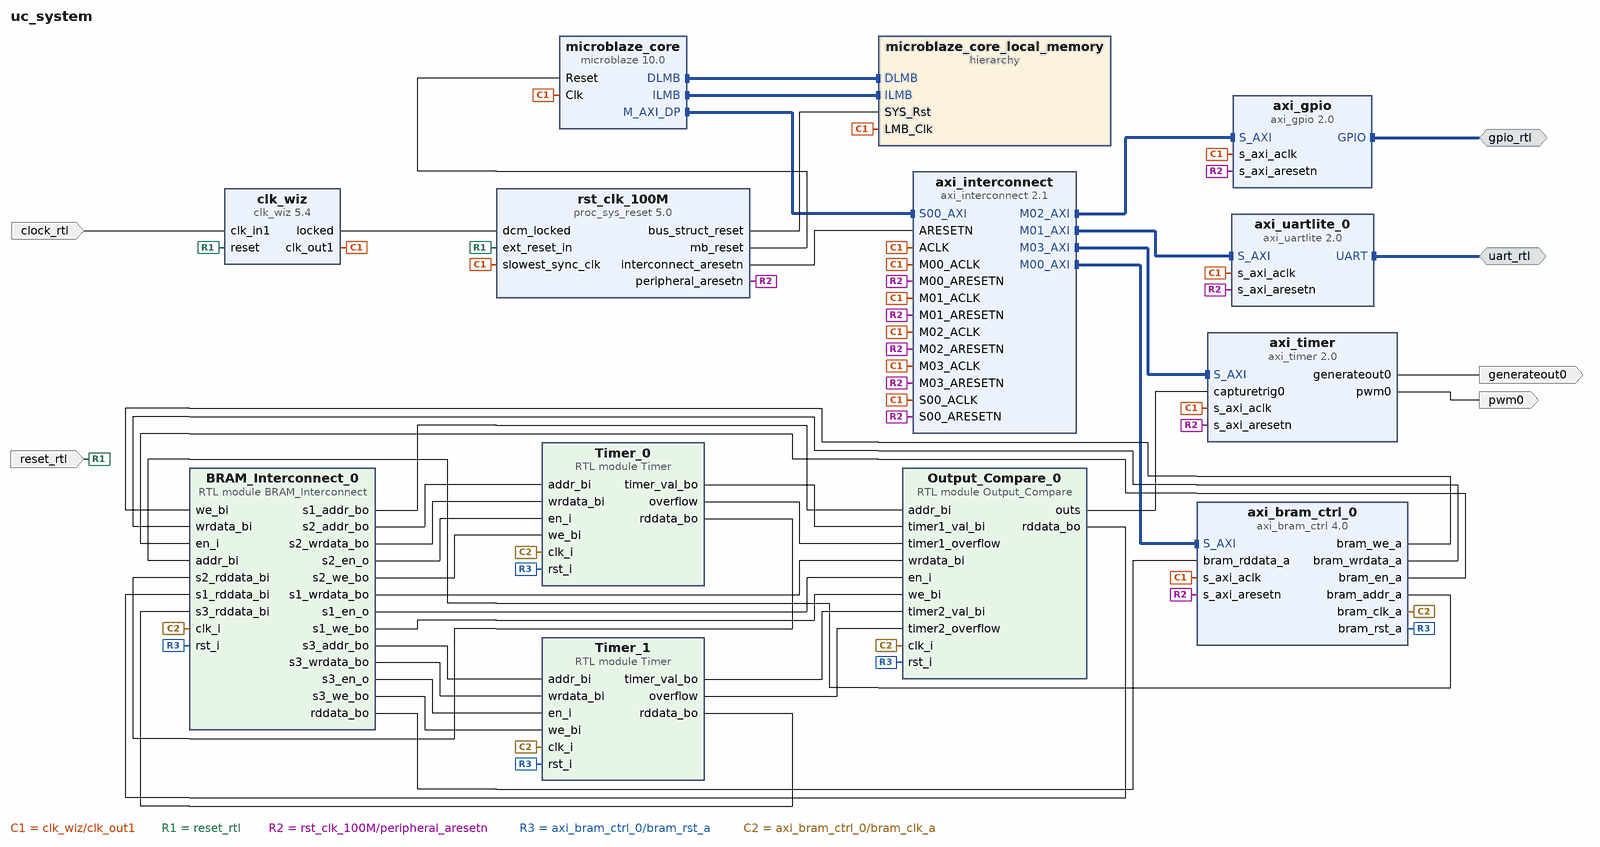
[diagram p0: block diagram of the top level]
# Vivado block design uc_system, xc7a100tcsg324-1, Vivado 2017.2
create_bd_design uc_system

create_bd_intf_port -mode Master -vlnv xilinx.com:interface:gpio_rtl:1.0 gpio_rtl
create_bd_intf_port -mode Master -vlnv xilinx.com:interface:uart_rtl:1.0 uart_rtl
create_bd_port -dir I -type rst reset_rtl
set_property -dict {CONFIG.POLARITY ACTIVE_HIGH} [get_bd_ports reset_rtl]
create_bd_port -dir I -type clk clock_rtl
set_property -dict {CONFIG.FREQ_HZ 100000000 CONFIG.PHASE 0.000} [get_bd_ports clock_rtl]
create_bd_port -dir O pwm0
create_bd_port -dir O generateout0

create_bd_cell -type ip -vlnv xilinx.com:ip:microblaze:10.0 microblaze_core
set_property -dict {CONFIG.C_D_AXI 1 CONFIG.C_D_LMB 1 CONFIG.C_I_LMB 1 CONFIG.C_DEBUG_ENABLED 0} [get_bd_cells microblaze_core]
create_bd_cell -type ip -vlnv xilinx.com:ip:clk_wiz:5.4 clk_wiz
create_bd_cell -type ip -vlnv xilinx.com:ip:proc_sys_reset:5.0 rst_clk_100M
create_bd_cell -type ip -vlnv xilinx.com:ip:axi_timer:2.0 axi_timer
create_bd_cell -type ip -vlnv xilinx.com:ip:axi_gpio:2.0 axi_gpio
set_property -dict {CONFIG.C_GPIO_WIDTH 16 CONFIG.C_ALL_OUTPUTS 1} [get_bd_cells axi_gpio]
create_bd_cell -type hier microblaze_core_local_memory
create_bd_cell -type ip -vlnv xilinx.com:ip:axi_interconnect:2.1 axi_interconnect
set_property -dict {CONFIG.NUM_MI 4} [get_bd_cells axi_interconnect]
create_bd_cell -type ip -vlnv xilinx.com:ip:axi_bram_ctrl:4.0 axi_bram_ctrl_0
set_property -dict {CONFIG.PROTOCOL AXI4 CONFIG.SINGLE_PORT_BRAM 1} [get_bd_cells axi_bram_ctrl_0]
create_bd_cell -type ip -vlnv xilinx.com:ip:axi_uartlite:2.0 axi_uartlite_0
set_property -dict {CONFIG.C_BAUDRATE 230400} [get_bd_cells axi_uartlite_0]
create_bd_cell -type module -reference BRAM_Interconnect BRAM_Interconnect_0
set_property -dict [list \
  CONFIG.addr1_0 24 \
  CONFIG.addr1_1 32 \
  CONFIG.addr2_0 0 \
  CONFIG.addr2_1 11 \
  CONFIG.addr3_0 12 \
  CONFIG.addr3_1 23 \
] [get_bd_cells BRAM_Interconnect_0]
create_bd_cell -type module -reference Timer Timer_0
create_bd_cell -type module -reference Timer Timer_1
set_property -dict {CONFIG.ADDRESS 0x0000000C} [get_bd_cells Timer_1]
create_bd_cell -type module -reference Output_Compare Output_Compare_0

# ---- hierarchy /microblaze_core_local_memory ----
current_bd_instance /microblaze_core_local_memory
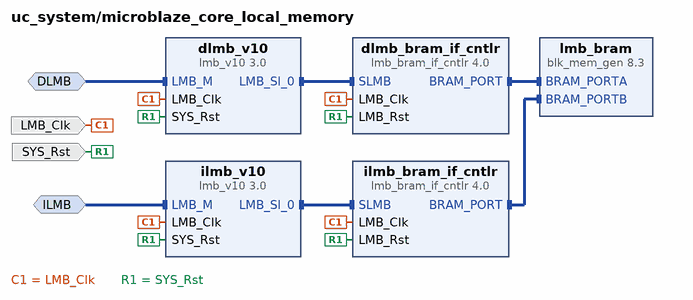
[diagram p1: block diagram inside /microblaze_core_local_memory]
create_bd_intf_pin -mode MirroredMaster -vlnv xilinx.com:interface:lmb_rtl:1.0 DLMB
create_bd_intf_pin -mode MirroredMaster -vlnv xilinx.com:interface:lmb_rtl:1.0 ILMB
create_bd_pin -dir I -type clk LMB_Clk
create_bd_pin -dir I -type rst SYS_Rst

create_bd_cell -type ip -vlnv xilinx.com:ip:lmb_v10:3.0 dlmb_v10
create_bd_cell -type ip -vlnv xilinx.com:ip:lmb_v10:3.0 ilmb_v10
create_bd_cell -type ip -vlnv xilinx.com:ip:lmb_bram_if_cntlr:4.0 dlmb_bram_if_cntlr
set_property -dict {CONFIG.C_ECC 0} [get_bd_cells dlmb_bram_if_cntlr]
create_bd_cell -type ip -vlnv xilinx.com:ip:lmb_bram_if_cntlr:4.0 ilmb_bram_if_cntlr
set_property -dict {CONFIG.C_ECC 0} [get_bd_cells ilmb_bram_if_cntlr]
create_bd_cell -type ip -vlnv xilinx.com:ip:blk_mem_gen:8.3 lmb_bram
set_property -dict {CONFIG.Memory_Type True_Dual_Port_RAM CONFIG.use_bram_block BRAM_Controller} [get_bd_cells lmb_bram]

# ---- connections ----

current_bd_instance /microblaze_core_local_memory
connect_bd_intf_net -intf_net microblaze_core_dlmb_bus [get_bd_intf_pins dlmb_v10/LMB_Sl_0] [get_bd_intf_pins dlmb_bram_if_cntlr/SLMB]
connect_bd_intf_net -intf_net microblaze_core_ilmb_bus [get_bd_intf_pins ilmb_v10/LMB_Sl_0] [get_bd_intf_pins ilmb_bram_if_cntlr/SLMB]
connect_bd_intf_net -intf_net microblaze_core_dlmb_cntlr [get_bd_intf_pins dlmb_bram_if_cntlr/BRAM_PORT] [get_bd_intf_pins lmb_bram/BRAM_PORTA]
connect_bd_intf_net -intf_net microblaze_core_ilmb_cntlr [get_bd_intf_pins ilmb_bram_if_cntlr/BRAM_PORT] [get_bd_intf_pins lmb_bram/BRAM_PORTB]
connect_bd_intf_net -intf_net microblaze_core_dlmb [get_bd_intf_pins DLMB] [get_bd_intf_pins dlmb_v10/LMB_M]
connect_bd_intf_net -intf_net microblaze_core_ilmb [get_bd_intf_pins ILMB] [get_bd_intf_pins ilmb_v10/LMB_M]
connect_bd_net -net microblaze_core_Clk [get_bd_pins LMB_Clk] \
  [get_bd_pins dlmb_v10/LMB_Clk] [get_bd_pins dlmb_bram_if_cntlr/LMB_Clk] [get_bd_pins ilmb_v10/LMB_Clk] \
  [get_bd_pins ilmb_bram_if_cntlr/LMB_Clk]
connect_bd_net [get_bd_pins SYS_Rst] \
  [get_bd_pins dlmb_v10/SYS_Rst] [get_bd_pins dlmb_bram_if_cntlr/LMB_Rst] [get_bd_pins ilmb_v10/SYS_Rst] \
  [get_bd_pins ilmb_bram_if_cntlr/LMB_Rst]

current_bd_instance /
connect_bd_intf_net [get_bd_intf_pins microblaze_core/DLMB] [get_bd_intf_pins microblaze_core_local_memory/DLMB]
connect_bd_intf_net [get_bd_intf_pins microblaze_core/ILMB] [get_bd_intf_pins microblaze_core_local_memory/ILMB]
connect_bd_intf_net [get_bd_intf_pins microblaze_core/M_AXI_DP] [get_bd_intf_pins axi_interconnect/S00_AXI]
connect_bd_intf_net [get_bd_intf_pins axi_interconnect/M00_AXI] [get_bd_intf_pins axi_bram_ctrl_0/S_AXI]
connect_bd_intf_net [get_bd_intf_pins axi_uartlite_0/S_AXI] [get_bd_intf_pins axi_interconnect/M01_AXI]
connect_bd_intf_net [get_bd_intf_pins axi_interconnect/M02_AXI] [get_bd_intf_pins axi_gpio/S_AXI]
connect_bd_intf_net [get_bd_intf_pins axi_interconnect/M03_AXI] [get_bd_intf_pins axi_timer/S_AXI]
connect_bd_intf_net [get_bd_intf_ports gpio_rtl] [get_bd_intf_pins axi_gpio/GPIO]
connect_bd_intf_net [get_bd_intf_ports uart_rtl] [get_bd_intf_pins axi_uartlite_0/UART]
connect_bd_net -net microblaze_core_Clk [get_bd_pins clk_wiz/clk_out1] \
  [get_bd_pins microblaze_core/Clk] [get_bd_pins rst_clk_100M/slowest_sync_clk] [get_bd_pins axi_timer/s_axi_aclk] \
  [get_bd_pins axi_gpio/s_axi_aclk] [get_bd_pins axi_bram_ctrl_0/s_axi_aclk] [get_bd_pins axi_uartlite_0/s_axi_aclk] \
  [get_bd_pins microblaze_core_local_memory/LMB_Clk] [get_bd_pins axi_interconnect/S00_ACLK] \
  [get_bd_pins axi_interconnect/M00_ACLK] [get_bd_pins axi_interconnect/ACLK] [get_bd_pins axi_interconnect/M01_ACLK] \
  [get_bd_pins axi_interconnect/M03_ACLK] [get_bd_pins axi_interconnect/M02_ACLK]
connect_bd_net [get_bd_pins rst_clk_100M/mb_reset] [get_bd_pins microblaze_core/Reset]
connect_bd_net [get_bd_pins clk_wiz/locked] [get_bd_pins rst_clk_100M/dcm_locked]
connect_bd_net [get_bd_pins rst_clk_100M/bus_struct_reset] [get_bd_pins microblaze_core_local_memory/SYS_Rst]
connect_bd_net [get_bd_ports reset_rtl] [get_bd_pins clk_wiz/reset] [get_bd_pins rst_clk_100M/ext_reset_in]
connect_bd_net [get_bd_ports clock_rtl] [get_bd_pins clk_wiz/clk_in1]
connect_bd_net [get_bd_pins rst_clk_100M/interconnect_aresetn] [get_bd_pins axi_interconnect/ARESETN]
connect_bd_net [get_bd_pins rst_clk_100M/peripheral_aresetn] \
  [get_bd_pins axi_timer/s_axi_aresetn] [get_bd_pins axi_gpio/s_axi_aresetn] [get_bd_pins axi_bram_ctrl_0/s_axi_aresetn] \
  [get_bd_pins axi_uartlite_0/s_axi_aresetn] [get_bd_pins axi_interconnect/S00_ARESETN] \
  [get_bd_pins axi_interconnect/M00_ARESETN] [get_bd_pins axi_interconnect/M01_ARESETN] \
  [get_bd_pins axi_interconnect/M02_ARESETN] [get_bd_pins axi_interconnect/M03_ARESETN]
connect_bd_net [get_bd_pins axi_bram_ctrl_0/bram_we_a] [get_bd_pins BRAM_Interconnect_0/we_bi]
connect_bd_net [get_bd_pins axi_bram_ctrl_0/bram_rst_a] \
  [get_bd_pins BRAM_Interconnect_0/rst_i] [get_bd_pins Timer_0/rst_i] [get_bd_pins Timer_1/rst_i] \
  [get_bd_pins Output_Compare_0/rst_i]
connect_bd_net [get_bd_pins axi_bram_ctrl_0/bram_clk_a] \
  [get_bd_pins BRAM_Interconnect_0/clk_i] [get_bd_pins Timer_0/clk_i] [get_bd_pins Timer_1/clk_i] \
  [get_bd_pins Output_Compare_0/clk_i]
connect_bd_net [get_bd_pins axi_bram_ctrl_0/bram_wrdata_a] [get_bd_pins BRAM_Interconnect_0/wrdata_bi]
connect_bd_net [get_bd_pins axi_bram_ctrl_0/bram_en_a] [get_bd_pins BRAM_Interconnect_0/en_i]
connect_bd_net [get_bd_pins axi_bram_ctrl_0/bram_addr_a] [get_bd_pins BRAM_Interconnect_0/addr_bi]
connect_bd_net [get_bd_pins BRAM_Interconnect_0/s1_addr_bo] [get_bd_pins Output_Compare_0/addr_bi]
connect_bd_net [get_bd_pins BRAM_Interconnect_0/s1_wrdata_bo] [get_bd_pins Output_Compare_0/wrdata_bi]
connect_bd_net [get_bd_pins BRAM_Interconnect_0/s1_en_o] [get_bd_pins Output_Compare_0/en_i]
connect_bd_net [get_bd_pins BRAM_Interconnect_0/s2_addr_bo] [get_bd_pins Timer_0/addr_bi]
connect_bd_net [get_bd_pins BRAM_Interconnect_0/s2_wrdata_bo] [get_bd_pins Timer_0/wrdata_bi]
connect_bd_net [get_bd_pins BRAM_Interconnect_0/s2_en_o] [get_bd_pins Timer_0/en_i]
connect_bd_net [get_bd_pins BRAM_Interconnect_0/s3_addr_bo] [get_bd_pins Timer_1/addr_bi]
connect_bd_net [get_bd_pins BRAM_Interconnect_0/s3_wrdata_bo] [get_bd_pins Timer_1/wrdata_bi]
connect_bd_net [get_bd_pins BRAM_Interconnect_0/s3_en_o] [get_bd_pins Timer_1/en_i]
connect_bd_net [get_bd_pins BRAM_Interconnect_0/s1_we_bo] [get_bd_pins Output_Compare_0/we_bi]
connect_bd_net [get_bd_pins BRAM_Interconnect_0/s2_we_bo] [get_bd_pins Timer_0/we_bi]
connect_bd_net [get_bd_pins BRAM_Interconnect_0/s3_we_bo] [get_bd_pins Timer_1/we_bi]
connect_bd_net -net BRAM_Interconnect_0_rddara_bo [get_bd_pins BRAM_Interconnect_0/rddata_bo] [get_bd_pins axi_bram_ctrl_0/bram_rddata_a]
connect_bd_net [get_bd_pins Output_Compare_0/rddata_bo] [get_bd_pins BRAM_Interconnect_0/s1_rddata_bi]
connect_bd_net [get_bd_pins Timer_0/rddata_bo] [get_bd_pins BRAM_Interconnect_0/s2_rddata_bi]
connect_bd_net [get_bd_pins Timer_1/rddata_bo] [get_bd_pins BRAM_Interconnect_0/s3_rddata_bi]
connect_bd_net [get_bd_pins Timer_0/timer_val_bo] [get_bd_pins Output_Compare_0/timer1_val_bi]
connect_bd_net [get_bd_pins Timer_1/timer_val_bo] [get_bd_pins Output_Compare_0/timer2_val_bi]
connect_bd_net [get_bd_pins Output_Compare_0/outs] [get_bd_pins axi_timer/capturetrig0]
connect_bd_net [get_bd_pins axi_timer/pwm0] [get_bd_ports pwm0]
connect_bd_net [get_bd_pins axi_timer/generateout0] [get_bd_ports generateout0]
connect_bd_net [get_bd_pins Timer_0/overflow] [get_bd_pins Output_Compare_0/timer1_overflow]
connect_bd_net [get_bd_pins Timer_1/overflow] [get_bd_pins Output_Compare_0/timer2_overflow]

# ---- address map ----
assign_bd_address -offset 0x00000000 -range 8K -target_address_space [get_bd_addr_spaces microblaze_core/Data] [get_bd_addr_segs microblaze_core_local_memory/dlmb_bram_if_cntlr/SLMB/Mem]
assign_bd_address -offset 0x40000000 -range 64K -target_address_space [get_bd_addr_spaces microblaze_core/Data] [get_bd_addr_segs axi_gpio/S_AXI/Reg]
assign_bd_address -offset 0x40600000 -range 64K -target_address_space [get_bd_addr_spaces microblaze_core/Data] [get_bd_addr_segs axi_uartlite_0/S_AXI/Reg]
assign_bd_address -offset 0x41C00000 -range 64K -target_address_space [get_bd_addr_spaces microblaze_core/Data] [get_bd_addr_segs axi_timer/S_AXI/Reg]
assign_bd_address -offset 0xC0000000 -range 8K -target_address_space [get_bd_addr_spaces microblaze_core/Data] [get_bd_addr_segs axi_bram_ctrl_0/S_AXI/Mem0]
assign_bd_address -offset 0x00000000 -range 8K -target_address_space [get_bd_addr_spaces microblaze_core/Instruction] [get_bd_addr_segs microblaze_core_local_memory/ilmb_bram_if_cntlr/SLMB/Mem]

validate_bd_design
save_bd_design
